# Altium schematic sheet LED.SchDoc
size A4
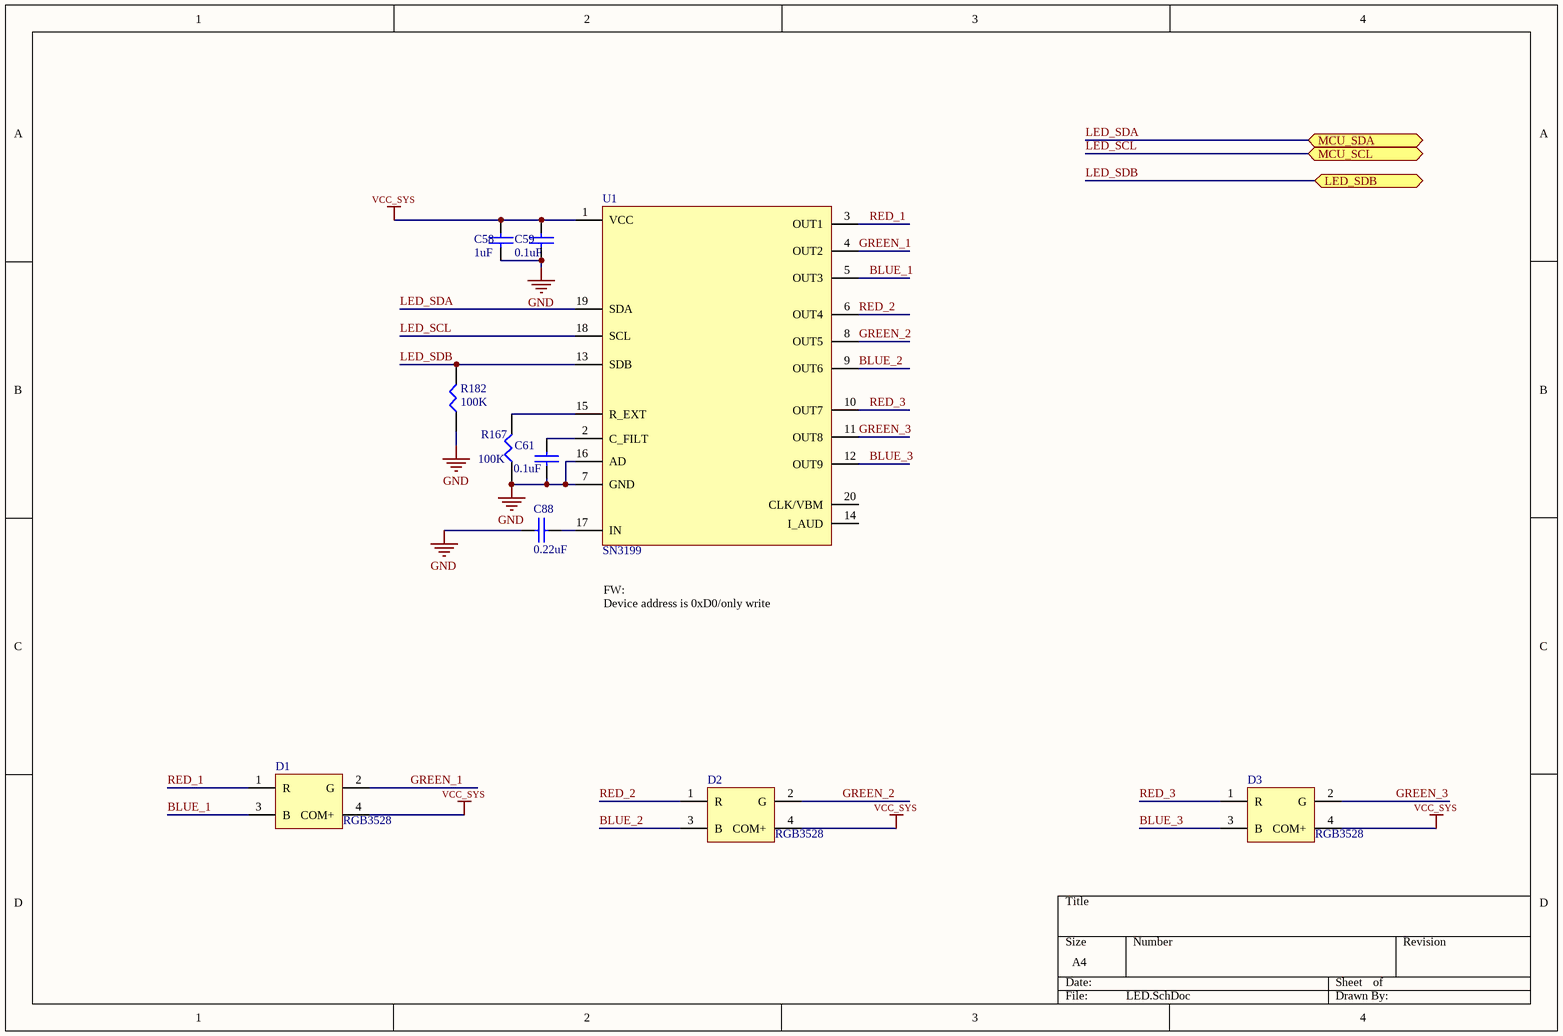
[diagram p0: LED.SchDoc]

## Parts
C58  1uF  [0402C]
C59  0.1uF  [0402C]
C61  0.1uF  [0402C]
C88  0.22uF  [0402C]
D1  RGB3528  [R6GHBHC]
D2  RGB3528  [R6GHBHC]
D3  RGB3528  [R6GHBHC]
R167  100K  [0402R]
R182  100K  [0402R]
U1  SN3199  [QFN20-B]

## Ports
LED_SDB, MCU_SCL, MCU_SDA

## Nets
GND: C58.2 C59.2 C61.2 C88.1 R167.1 R182.1 U1.7(GND) U1.16(AD)
VCC_SYS: C58.1 C59.1 D1.4(COM+) D2.4(COM+) D3.4(COM+) U1.1(VCC)
BLUE_1: D1.3(B) U1.5(OUT3)
BLUE_2: D2.3(B) U1.9(OUT6)
BLUE_3: D3.3(B) U1.12(OUT9)
GREEN_1: D1.2(G) U1.4(OUT2)
GREEN_2: D2.2(G) U1.8(OUT5)
GREEN_3: D3.2(G) U1.11(OUT8)
LED_SCL: U1.18(SCL) ; port MCU_SCL
LED_SDA: U1.19(SDA) ; port MCU_SDA
LED_SDB: R182.2 U1.13(SDB) ; port LED_SDB
RED_1: D1.1(R) U1.3(OUT1)
RED_2: D2.1(R) U1.6(OUT4)
RED_3: D3.1(R) U1.10(OUT7)
NetC61_1: C61.1 U1.2(C_FILT)
NetC88_2: C88.2 U1.17(IN)
NetR167_2: R167.2 U1.15(R_EXT)

Not connected (* = marked no-connect by the designer): U1 14(I_AUD) 20(CLK/VBM)

## Notes on the sheet
- FW:
  Device address is 0xD0/only write

## Library data of the parts
C58 = CAP: 1uF/10V/X7R/10%，0402
C59 C61 = CAP: 0.1uF/10V/X7R/10%，0402
C88 = CAP: 0.22uF/10V/X7R/10%，0402
R167 R182 = RES: 100K/5%，0402
U1 = SN3199: 厂家：SI-EN，型号：IS31FL3199-QFLS2-TR
D1-D3 = RGB3528: Published: 24-Mar-1999; LatestRevisionDate: 17-Jul-2002; LatestRevisionNote: Re-released for DXP Platform.; PackageReference: D-46_6A; Publisher: Altium Limited; PackageDescription: Bridge Rectifier; 4 Terminals; Body 16.8 x 16.8 mm (typ); Pitch 10.67 mm